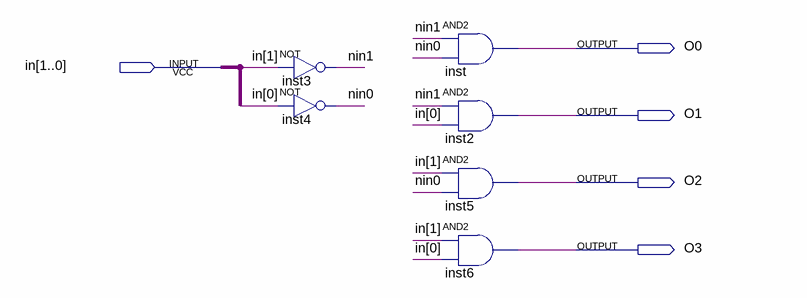
[diagram p0: schematic sheet]
// Quartus schematic decoderSEL(1).bdf as structural Verilog: 6 symbols, 5 pins
module \decoderSEL(1)  (
  input  [1:0] in,
  output O0,
  output O1,
  output O2,
  output O3
);

  wire nin0, nin1;

  not inst3 (nin1, in[1]);
  not inst4 (nin0, in[0]);
  and inst (O0, nin1, nin0);
  and inst2 (O1, nin1, in[0]);
  and inst5 (O2, in[1], nin0);
  and inst6 (O3, in[1], in[0]);
endmodule
